# EAGLE design Vector_XY_Driver (EAGLE 9.0.1)
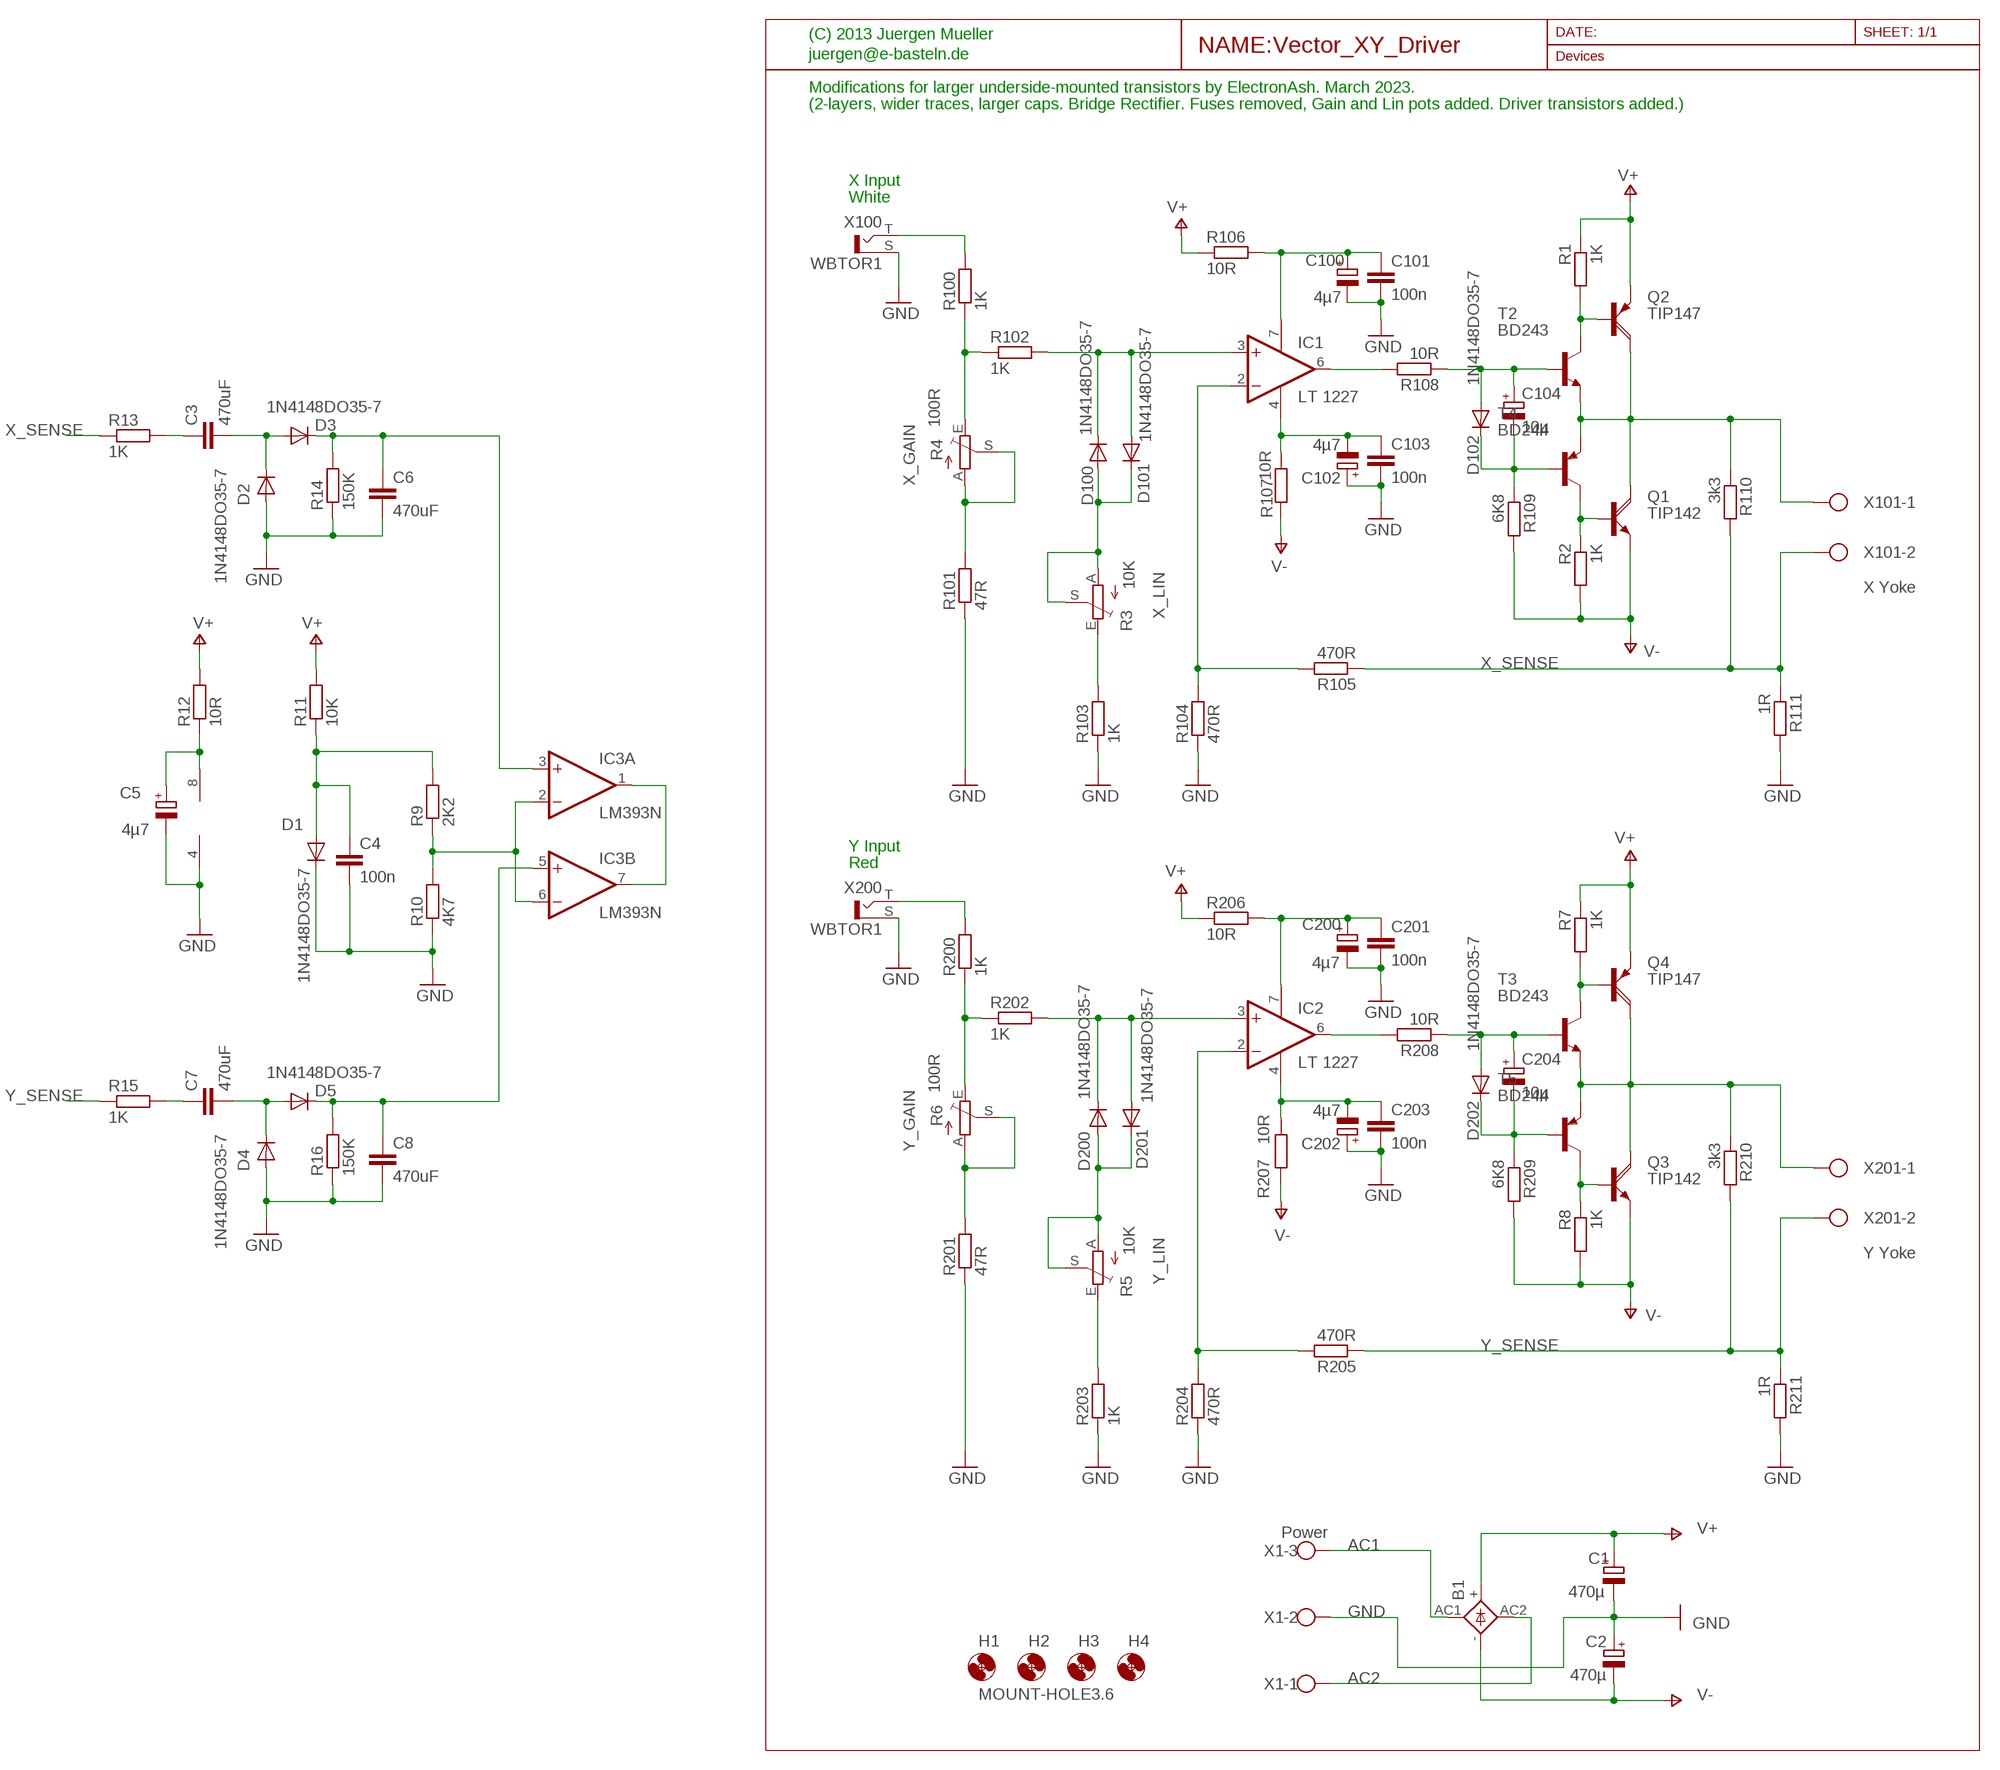
[diagram p0: schematic, sheet 1]

## Parts
B1  2KBP  [2KBP]
C1  470µ  CPOL-EUE7.5-16  [E7,5-16]
C2  470µ  CPOL-EUE7.5-16  [E7,5-16]
C3  470uF  C-EU025_050-025X075  [C025_050-025X075]
C4  100n  C-EU025_050-025X075  [C025_050-025X075]
C5  4µ7  CPOL-EUE2.5-6  [E2,5-6]
C6  470uF  C-EU025_050-025X075  [C025_050-025X075]
C7  470uF  C-EU025_050-025X075  [C025_050-025X075]
C8  470uF  C-EU025_050-025X075  [C025_050-025X075]
C100  4µ7  CPOL-EUE2.5-6  [E2,5-6]
C101  100n  C-EU025_050-025X075  [C025_050-025X075]
C102  4µ7  CPOL-EUE2.5-6  [E2,5-6]
C103  100n  C-EU025_050-025X075  [C025_050-025X075]
C104  10µ  CPOL-EUE15-5AXIAL  [E15-5]
C200  4µ7  CPOL-EUE2.5-6  [E2,5-6]
C201  100n  C-EU025_050-025X075  [C025_050-025X075]
C202  4µ7  CPOL-EUE2.5-6  [E2,5-6]
C203  100n  C-EU025_050-025X075  [C025_050-025X075]
C204  10µ  CPOL-EUE15-5AXIAL  [E15-5]
D1  1N4148DO35-7  [DO35-7]
D2  1N4148DO35-7  [DO35-7]
D3  1N4148DO35-7  [DO35-7]
D4  1N4148DO35-7  [DO35-7]
D5  1N4148DO35-7  [DO35-7]
D100  1N4148DO35-7  [DO35-7]
D101  1N4148DO35-7  [DO35-7]
D102  1N4148DO35-7  [DO35-7]
D200  1N4148DO35-7  [DO35-7]
D201  1N4148DO35-7  [DO35-7]
D202  1N4148DO35-7  [DO35-7]
H1  MOUNT-HOLE3.6  [3,6]
H2  MOUNT-HOLE3.6  [3,6]
H3  MOUNT-HOLE3.6  [3,6]
H4  MOUNT-HOLE3.6  [3,6]
IC1  LT 1227  1AMP_P7+4N  [DIL08]
IC2  LT 1227  1AMP_P7+4N  [DIL08]
IC3  LM393N  [DIL08]
Q1  TIP142  [SOT93]
Q2  TIP147  [SOT93]
Q3  TIP142  [SOT93]
Q4  TIP147  [SOT93]
R1  1K  R-EU_0207/10  [0207/10]
R2  1K  R-EU_0207/10  [0207/10]
R3  10K  TRIM_EU-B25P  [B25P]
R4  100R  TRIM_EU-B25P  [B25P]
R5  10K  TRIM_EU-B25P  [B25P]
R6  100R  TRIM_EU-B25P  [B25P]
R7  1K  R-EU_0207/10  [0207/10]
R8  1K  R-EU_0207/10  [0207/10]
R9  2K2  R-EU_0207/10  [0207/10]
R10  4K7  R-EU_0207/10  [0207/10]
R11  10K  R-EU_0207/10  [0207/10]
R12  10R  R-EU_0207/10  [0207/10]
R13  1K  R-EU_0207/10  [0207/10]
R14  150K  R-EU_0207/10  [0207/10]
R15  1K  R-EU_0207/10  [0207/10]
R16  150K  R-EU_0207/10  [0207/10]
R100  1K  R-EU_0207/10  [0207/10]
R101  47R  R-EU_0207/10  [0207/10]
R102  1K  R-EU_0207/10  [0207/10]
R103  1K  R-EU_0207/10  [0207/10]
R104  470R  R-EU_0207/10  [0207/10]
R105  470R  R-EU_0207/10  [0207/10]
R106  10R  R-EU_0207/12  [0207/12]
R107  10R  R-EU_0207/12  [0207/12]
R108  10R  R-EU_0207/12  [0207/12]
R109  6K8  R-EU_0207/10  [0207/10]
R110  3k3  R-EU_0207/10  [0207/10]
R111  1R  R-EU_0617/17  [0617/17]
R200  1K  R-EU_0207/10  [0207/10]
R201  47R  R-EU_0207/10  [0207/10]
R202  1K  R-EU_0207/10  [0207/10]
R203  1K  R-EU_0207/10  [0207/10]
R204  470R  R-EU_0207/10  [0207/10]
R205  470R  R-EU_0207/10  [0207/10]
R206  10R  R-EU_0207/12  [0207/12]
R207  10R  R-EU_0207/12  [0207/12]
R208  10R  R-EU_0207/12  [0207/12]
R209  6K8  R-EU_0207/10  [0207/10]
R210  3k3  R-EU_0207/10  [0207/10]
R211  1R  R-EU_0617/17  [0617/17]
T2  BD243  [TO220]
T3  BD243  [TO220]
T4  BD244  [TO220]
T5  BD244  [TO220]
X1  Power  W237-103  [W237-103]
X100  WBTOR1  [WBTOR1]
X101  X Yoke  W237-102  [W237-102]
X200  WBTOR1  [WBTOR1]
X201  Y Yoke  W237-102  [W237-102]

## Nets
AC1: B1.AC1 X1.3
AC2: B1.AC2 X1.1
GND: C1.- C2.+ C4.2 C5.- C6.2 C8.2 C100.- C101.2 C102.+ C103.2 C200.- C201.2 C202.+ C203.2 D1.C D2.A D4.A IC3.4(P:V-) R10.1 R14.1 R16.1 R101.1 R103.1 R104.1 R111.2 R201.1 R203.1 R204.1 R211.2 X1.2 X100.S X200.S
N$1: C102.- C103.1 IC1.4(V-) R107.1
N$2: C100.+ C101.1 IC1.7(V+) R106.2
N$3: IC1.2(-IN) R104.2 R105.2
N$4: R3.E R103.2
N$5: IC1.6(OUT) R108.2
N$6: C104.+ D102.A R108.1 T2.1(B)
N$7: C104.- D102.C R109.1 T4.1(B)
N$8: Q2.B R1.2 T2.2(C)
N$9: D100.A D101.C R3.A R3.S
N$10: R5.E R203.2
N$11: IC3.1(A:OUT) IC3.7(B:OUT)
N$14: D100.C D101.A IC1.3(+IN) R102.2
N$15: R4.E R100.1 R102.1
N$16: R100.2 X100.T
N$17: C202.- C203.1 IC2.4(V-) R207.1
N$18: C200.+ C201.1 IC2.7(V+) R206.2
N$19: IC2.6(OUT) R208.2
N$20: C204.+ D202.A R208.1 T3.1(B)
N$21: C204.- D202.C R209.1 T5.1(B)
N$22: Q3.C Q4.C R210.1 T3.3(E) T5.3(E) X201.1
N$23: Q1.C Q2.C R110.1 T2.3(E) T4.3(E) X101.1
N$25: Q1.B R2.1 T4.2(C)
N$26: IC2.2(-IN) R204.2 R205.2
N$27: C5.+ IC3.8(P:V+) R12.1
N$28: D200.C D201.A IC2.3(+IN) R202.2
N$29: R6.E R200.1 R202.1
N$30: R200.2 X200.T
N$31: R4.A R4.S R101.2
N$32: R6.A R6.S R201.2
N$33: D200.A D201.C R5.A R5.S
N$34: Q3.B R8.1 T5.2(C)
N$35: Q4.B R7.2 T3.2(C)
N$36: IC3.2(A:-IN) IC3.6(B:-IN) R9.1 R10.2
N$37: C4.1 D1.A R9.2 R11.1
N$40: C6.1 D3.C IC3.3(A:+IN) R14.2
N$41: C3.2 D2.C D3.A
N$42: C3.1 R13.2
N$43: C8.1 D5.C IC3.5(B:+IN) R16.2
N$44: C7.2 D4.C D5.A
N$45: C7.1 R15.2
V+: B1.+ C1.+ Q2.E Q4.E R1.1 R7.1 R11.2 R12.2 R106.1 R206.1
V-: B1.- C2.- Q1.E Q3.E R2.2 R8.2 R107.2 R109.2 R207.2 R209.2
X_SENSE: R13.1 R105.1 R110.2 R111.1 X101.2
Y_SENSE: R15.1 R205.1 R210.2 R211.1 X201.2

## Notes on the sheet
- (C) 2013 Juergen Mueller
- juergen@e-basteln.de
- Modifications for larger underside-mounted transistors by ElectronAsh. March 2023.
- (2-layers, wider traces, larger caps. Bridge Rectifier. Fuses removed, Gain and Lin pots added. Driver transistors added.)
- X Input
- White
- X_GAIN
- X_LIN
- Y Input
- Red
- Y_GAIN
- Y_LIN

## Library data of the parts
B1 = rectifier:2KBP: RECTIFIER grid 3 x 3,81 mm
C1 C2 C5 C100 C102 C104 C200 C202 C204 = rcl:CPOL-EU: POLARIZED CAPACITOR, European symbol
C3 C4 C6-C8 C101 C103 C201 C203 = rcl:C-EU: CAPACITOR, European symbol
D1-D5 D100-D102 D200-D202 = diode:1N4148: DIODE high speed (Philips)
H1-H4 = holes:MOUNT-HOLE: MOUNTING HOLE with drill center marker
IC1 IC2 = linear:1AMP_P7+4: OP AMP
IC3 = linear:LM393: COMPARATOR
Q1 Q3 = transistor-power:TIP142: NPN DARLINGTON TRANSISTOR
Q2 Q4 = transistor-power:TIP147: PNP DARLINGTON TRANSISTOR
R1 R2 R7-R16 R100-R111 R200-R211 = rcl:R-EU_: RESISTOR, European symbol
R3-R6 = pot:TRIM_EU-: POTENTIOMETER
T2 T3 = transistor:BD243: NPN TRANSISTOR Source: Motorola Semiconductor, Master Selection Guide Q3/95 SG73 REV 8 page 5.5-4
T4 T5 = transistor:BD244: PNP TRANSISTOR Source: Motorola Semiconductor, Master Selection Guide Q3/95 SG73 REV 8 page 5.5-5
X1 = con-wago-500:W237-103: WAGO SCREW CLAMP; MPN: 237-103; OC_FARNELL: unknown; OC_NEWARK: 18M7116
X100 X200 = con-lumberg:WBTOR1: RCA connectors according to JEITA RC-5231 Cinch RCA-Einbaukupplung nach JEITA RC-5231, abgewinkelte Ausführung Source: http://www.lumberg.de/Produkte/PDFs/WBTOR1.pdf; MPN: WBTOR 1 BLACK; OC_FARNELL: 1200146; OC_NEWARK: 98K2588
X101 X201 = con-wago-500:W237-102: WAGO SCREW CLAMP; MPN: 237-102; OC_FARNELL: unknown; OC_NEWARK: 70K9898

## Board
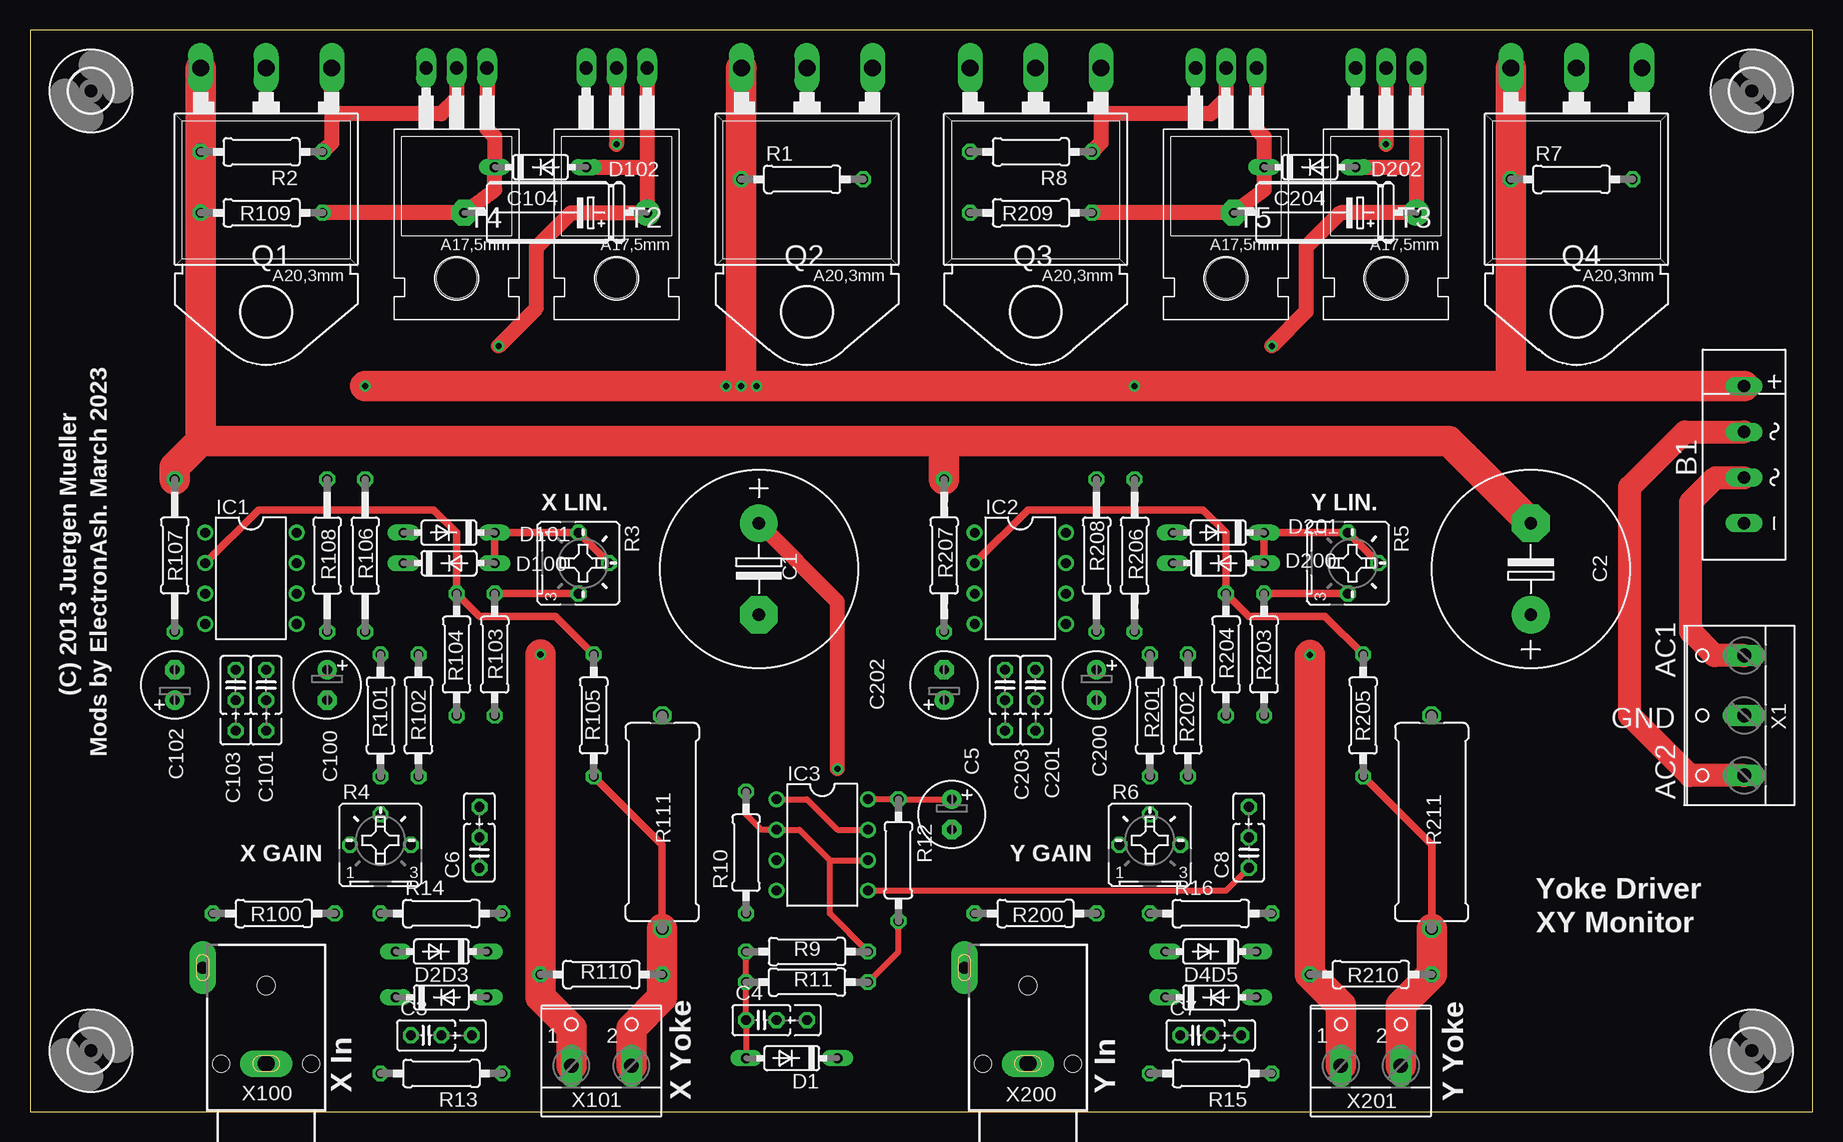
[diagram p1: board, top side]
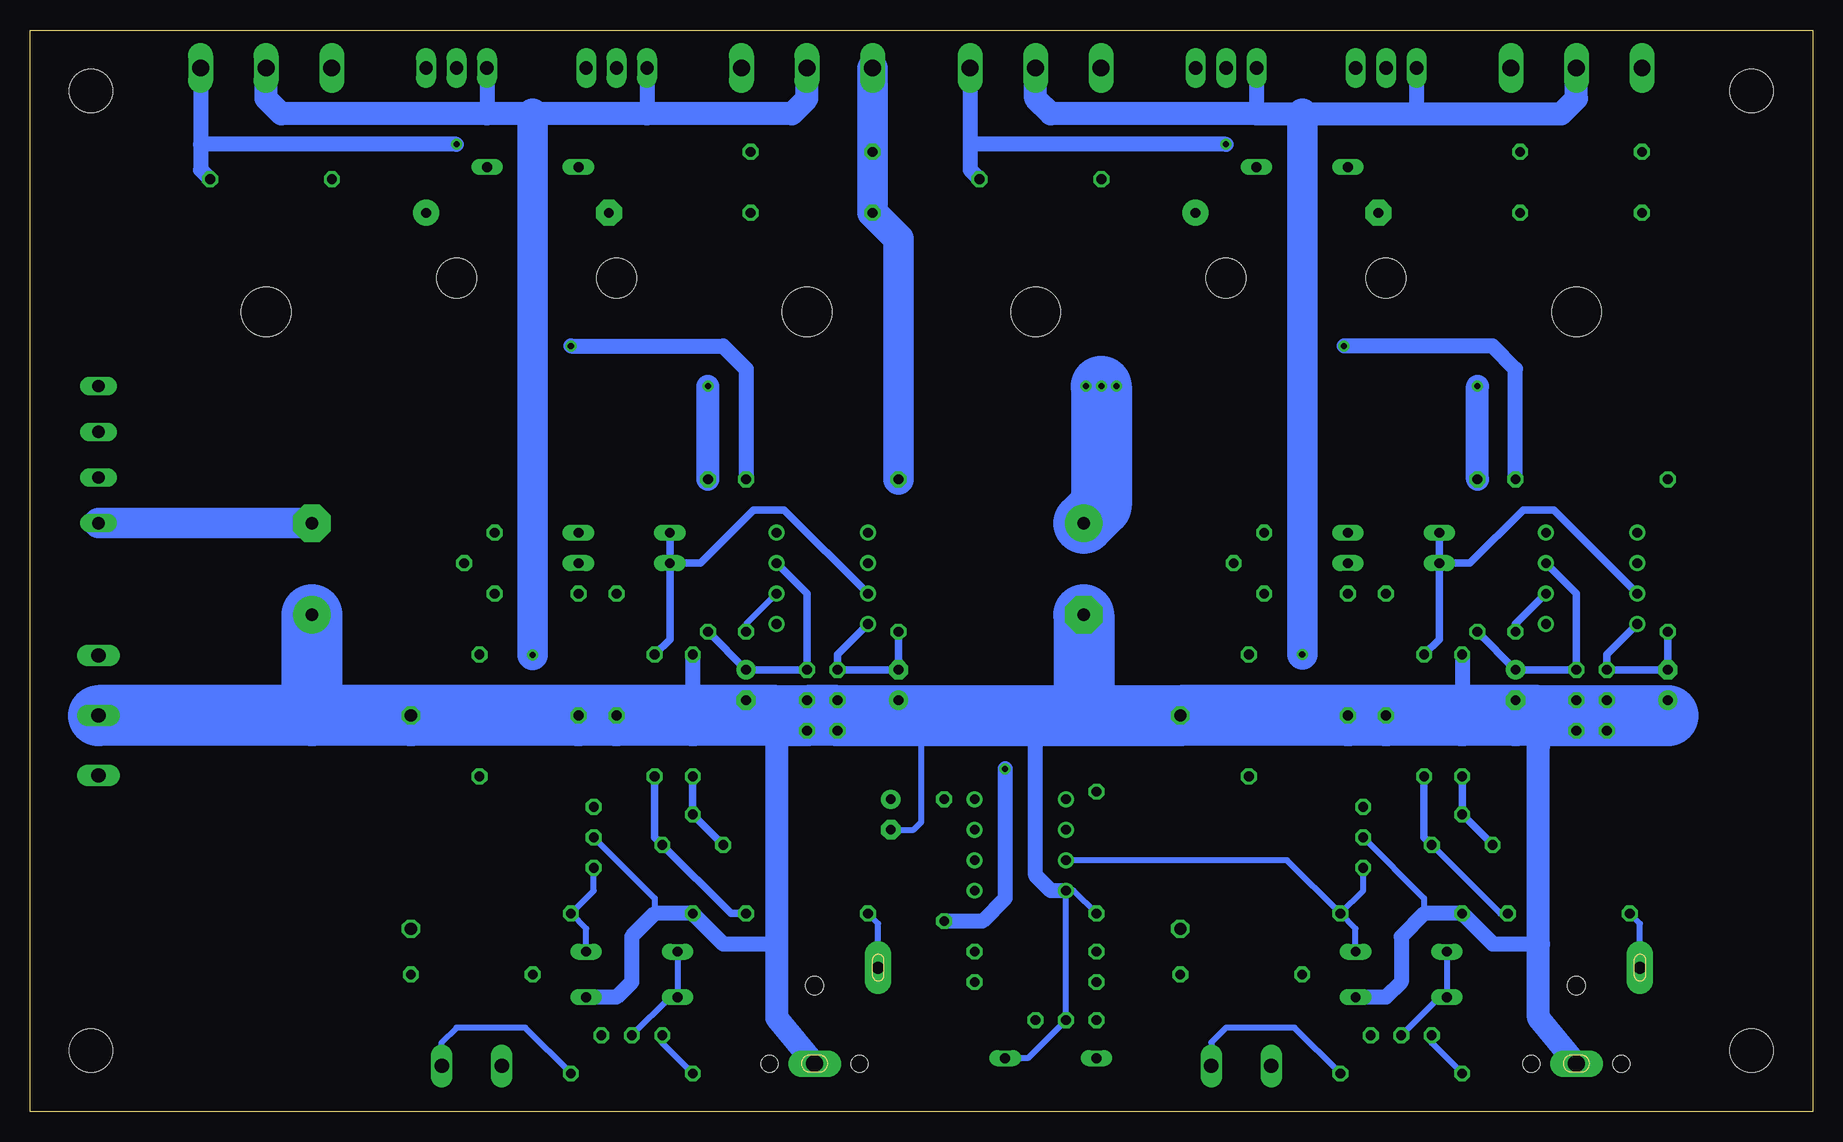
[diagram p2: board, bottom side, seen from below]

Size 148.59 x 90.17 mm. Coordinates in mm from the lower left corner, seen from the top.
Outline: 0,0 148.59,0 148.59,90.17 0,90.17 0,0
Copper layers (1*16): Top 0.035mm / dielectric 1.5mm / Bottom 0.035mm
Design rules "default *": minimum track width 10mil, minimum drill 20mil, track to track 8mil, track to pad 8mil, pad to pad 8mil, via to via 8mil, smd to smd 8mil, copper to edge 40mil, drill to drill 8mil, minimum pad ring 10mil, minimum via ring 8mil, stop-mask expansion 4mil, vias tented up to drill 24mil, thermal gap 10mil

### Footprints (pad centres in the part's own frame; a part is rotated, then mirrored left to right if it is on the bottom)
2KBP = drill 1.016 long: + 5.715,0; - -5.715,0; AC1 -1.905,0; AC2 1.905,0
E7,5-16 = drill 1.016 pad 3.15: + -3.81,0 | drill 1.016 pad 3.15 octagon: - 3.81,0
C025_050-025X075 = drill 0.813 octagon: 1 -1.27,0; 2 1.27,0; 3 3.81,0
E2,5-6 = drill 0.813 pad 1.6: + -1.27,0 | drill 0.813 pad 1.6 octagon: - 1.27,0
E15-5 = drill 0.813 pad 2.159: + -7.62,0 | drill 0.813 pad 2.159 octagon: - 7.62,0
DO35-7 = drill 0.813 long: A 3.81,0; C -3.81,0
3,6 = hole 3.6: 0,0
DIL08 = drill 0.813 pad 1.27: 1 -3.81,-3.81; 2 -1.27,-3.81; 3 1.27,-3.81; 4 3.81,-3.81; 5 3.81,3.81; 6 1.27,3.81; 7 -1.27,3.81; 8 -3.81,3.81
SOT93 = drill 1.397 long: B -5.461,-10.16; C 0,-10.16; E 5.461,-10.16 | hole 4.115: 0,10.16
0207/10 = drill 0.813 octagon: 1 -5.08,0; 2 5.08,0
B25P = drill 0.813 octagon: A -2.54,0; E 2.54,0; S 0,2.54
0207/12 = drill 0.813 octagon: 1 -6.35,0; 2 6.35,0
0617/17 = drill 1.016 octagon: 1 -8.89,0; 2 8.89,0
TO220 = drill 1.118 long: 1 -2.54,-6.35; 2 0,-6.35; 3 2.54,-6.35 | hole 3.302: 0,11.176
W237-103 = drill 1.194 long: 1 -5,-1.29; 2 0,-1.29; 3 5,-1.29
WBTOR1 = drill 1.4 pad 2.2 long: S 0,-4 | drill 1 pad 2.2 long: T 5.3,-12 | hole 1.4: -3.75,-4; 3.75,-4 | hole 1.5: 0,-10.5
W237-102 = drill 1.194 long: 1 -2.5,-1.27; 2 2.5,-1.27

### Placement (x,y rotation side)
B1  142.88,54.76 90 top
C1  60.75,45.24 270 top
C2  125.09,45.24 90 top
C3  33.02,6.35 0 top
C4  60.96,7.62 0 top
C5  76.83,24.77 270 top
C6  37.47,21.59 90 top
C7  97.16,6.35 0 top
C8  101.6,21.59 90 top
C100  24.77,35.56 270 top
C101  19.68,35.56 270 top
C102  12.06,35.56 90 top
C103  17.14,35.56 270 top
C104  43.81,74.93 180 top
C200  88.9,35.56 270 top
C201  83.82,35.56 270 top
C202  76.2,35.56 90 top
C203  81.28,35.56 270 top
C204  107.95,74.93 180 top
D1  63.5,4.45 180 top
D2  34.29,9.52 0 top
D3  34.29,13.34 180 top
D4  98.42,9.52 0 top
D5  98.42,13.34 180 top
D100  34.92,45.72 0 top
D101  34.92,48.26 180 top
D102  42.55,78.74 0 top
D200  99.06,45.72 0 top
D201  99.06,48.26 180 top
D202  106.68,78.74 0 top
H1  5.08,85.09 0 top
H2  5.08,5.08 0 top
H3  143.51,5.08 0 top
H4  143.51,85.09 0 top
IC1  18.41,44.45 270 top
IC2  82.55,44.45 270 top
IC3  66.04,22.23 270 top
Q1  19.68,76.84 180 top
Q2  64.77,76.84 180 top
Q3  83.82,76.84 180 top
Q4  128.91,76.84 180 top
R1  64.36,77.72 0 top
R2  19.3,80.01 180 top
R3  45.72,45.72 270 top
R4  29.21,22.23 0 top
R5  109.86,45.72 270 top
R6  93.34,22.23 0 top
R7  128.5,77.72 0 top
R8  83.44,80.01 180 top
R9  64.77,13.34 180 top
R10  59.69,21.59 90 top
R11  64.77,10.8 0 top
R12  72.39,20.95 270 top
R13  34.29,3.18 180 top
R14  34.29,16.51 0 top
R15  98.42,3.18 180 top
R16  98.42,16.51 0 top
R100  20.32,16.51 180 top
R101  29.21,33.02 270 top
R102  32.38,33.02 90 top
R103  38.73,38.1 90 top
R104  35.56,38.1 90 top
R105  46.99,33.02 90 top
R106  27.94,46.35 270 top
R107  12.06,46.35 90 top
R108  24.77,46.35 270 top
R109  19.3,74.93 180 top
R110  47.62,11.43 0 top
R111  52.7,24.13 90 top
R200  83.82,16.51 180 top
R201  93.34,33.02 270 top
R202  96.52,33.02 90 top
R203  102.87,38.1 90 top
R204  99.69,38.1 90 top
R205  111.12,33.02 90 top
R206  92.08,46.35 270 top
R207  76.2,46.35 90 top
R208  88.9,46.35 270 top
R209  83.44,74.93 180 top
R210  111.76,11.43 0 top
R211  116.84,24.13 90 top
T2  48.9,80.65 180 top
T3  113.03,80.65 180 top
T4  35.56,80.65 180 top
T5  99.69,80.65 180 top
X1  141.6,33.02 90 top
X100  19.68,0 180 top
X101  47.62,5.08 0 top
X200  83.19,0 180 top
X201  111.76,5.08 0 top

### Tracks (layer width: path | path; a pad name or v marks a point on that pad's centre or on a via)
AC1
  Top 1.93: X1.3 140.41,38.02 138.43,40.01 138.43,50.8 140.49,52.86 B1.AC1
AC2
  Top 1.93: X1.1 138.35,28.02 133.35,33.02 133.35,52.07 137.95,56.67 B1.AC2
GND
  Bottom 0.254: 17.14,33.02 C103.2 | 81.28,33.02 C203.2 | 83.82,33.02 C201.2 | 12.06,33.02 C102.+ | 24.77,33.02 C100.- | 22.86,30.48 22.86,33.02
  Bottom 0.508: C203.2 C202.+ 74.3,33.66 74.3,24.13 74.93,23.49 C5.- | R10.1 61.59,18.41 IC3.4 C4.2 65.41,4.45 D1.C | C8.2 96.52,17.78 96.52,16.51 | C6.2 32.38,17.78 32.38,16.51
  Bottom 1.27: R201.1 93.34,33.02 | R101.1 29.21,33.02 | IC3.4 63.5,18.41 64.77,19.68 64.77,33.02 | 22.86,13.97 26.67,13.97 R14.1 32.38,16.51 34.29,14.61 34.29,10.8 35.56,9.52 D2.A | 86.36,13.97 90.81,13.97 R16.1 96.52,16.51 98.42,14.61 98.42,10.8 99.69,9.52 D4.A
  Bottom 1.676: 19.68,33.02 C101.2
  Bottom 1.93: X100.S 22.86,7.81 22.86,13.97 22.86,30.48 | 36.83,31.75 R104.1 | C200.- 86.36,33.02 86.36,13.97 86.36,7.81 X200.S
  Bottom 5.08: 12.06,33.02 17.14,33.02 19.68,33.02 22.86,33.02 24.77,33.02 29.21,33.02 R104.1 R103.1 R111.2 60.96,33.02 | 60.96,33.02 64.77,33.02 81.28,33.02 83.82,33.02 86.36,33.02 93.34,33.02 R204.1 R203.1 R211.2 125.09,33.02 | 125.09,33.02 X1.2 | C2.+ 125.09,33.02 | C1.- 60.75,33.23 60.96,33.02
N$1
  Bottom 0.61: IC1.4 17.14,38.1 C103.1 C102.- R107.1
N$2
  Bottom 0.61: IC1.7 19.68,43.18 C101.1 C100.+ R106.2
N$3
  Top 0.61: IC1.2 19.05,50.16 33.66,50.16 35.56,48.26 R104.2 37.47,41.27 43.81,41.27 R105.2
N$4
  Top 0.61: R103.2 R3.E
N$5
  Bottom 0.61: IC1.6 24.77,40.64 R108.2
N$6  (via drill 0.51)
  Top 1.27: T2.1 51.44,78.74 | 51.44,78.74 C104.+ 45.09,74.93 42.23,72.07 42.23,66.99 v39.05,63.82 | D102.A 51.44,78.74
  Bottom 1.27: R108.1 24.77,61.91 26.67,63.82 v39.05,63.82
N$7
  Top 1.27: R109.1 C104.- 38.73,76.84 D102.C 38.73,81.28 38.1,81.91 T4.1
N$8  (via drill 0.51)
  Top 1.27: T2.2 v48.9,80.65
  Bottom 1.27: Q2.B 70.23,80.65 | 70.23,80.65 70.23,78.51 R1.2 | v48.9,80.65 70.23,80.65
N$9
  Top 0.61: D100.A D101.C R3.A R3.S
N$10
  Top 0.61: R203.2 R5.E
N$11
  Top 0.508: IC3.1 64.77,26.04 67.31,23.49 IC3.7
N$14
  Bottom 0.61: D100.C D101.A | IC1.3 21.59,50.16 24.13,50.16 28.57,45.72 D100.C | R102.2 31.11,39.37 D100.C
N$15
  Bottom 0.508: R100.1 26.04,16.51 R4.E
  Bottom 0.61: R4.E 32.38,22.86 R102.1
N$16
  Bottom 0.508: X100.T 14.38,15.66 R100.2
N$17
  Bottom 0.61: R207.1 C202.- C203.1 81.28,38.1 IC2.4
N$18
  Bottom 0.61: R206.2 C200.+ C201.1 83.82,43.18 IC2.7
N$19
  Bottom 0.508: IC2.6 88.9,40.64 R208.2
N$20  (via drill 0.51)
  Top 1.27: T3.1 115.57,78.74 | 115.57,78.74 C204.+ 109.22,74.93 106.36,72.07 106.36,66.68 v103.5,63.82 | D202.A 115.57,78.74
  Bottom 1.27: v103.5,63.82 90.81,63.82 88.9,61.91 R208.1
N$21
  Top 1.27: R209.1 C204.- 102.87,76.84 D202.C 102.87,81.28 102.23,81.91 T5.1
N$22  (via drill 0.51)
  Top 2.54: X201.1 109.26,8.85 R210.1 v106.68,38.06
  Bottom 1.27: T3.3 110.49,83.19 | T5.3 97.16,83.19
  Bottom 1.93: Q3.C 83.82,84.46 85.09,83.19 97.16,83.19 106.68,83.19 110.49,83.19 127.64,83.19 128.91,84.46 Q4.C
  Bottom 2.54: v106.68,38.06 106.68,83.19
N$23  (via drill 0.51)
  Top 2.54: v42.55,38.1 R110.1 42.55,9.52 45.12,6.95 X101.1
  Bottom 1.27: T4.3 33.02,83.19 | T2.3 46.35,83.19
  Bottom 1.93: Q2.C 64.77,84.46 63.5,83.19 46.35,83.19 42.55,83.19 33.02,83.19 20.95,83.19 19.68,84.46 Q1.C
  Bottom 2.54: v42.55,38.1 42.55,83.19
N$25
  Top 1.27: T4.2 35.56,84.46 34.29,83.19 25.15,83.19 | 25.15,83.19 Q1.B | 25.15,83.19 25.15,80.77 R2.1
N$26
  Top 0.61: IC2.2 83.19,50.16 97.79,50.16 99.69,48.26 R204.2 101.6,41.27 107.95,41.27 R205.2
N$27
  Top 0.508: IC3.8 R12.1 C5.+
N$28
  Bottom 0.61: D200.C D201.A | R202.2 95.25,39.37 D200.C | IC2.3 85.72,50.16 88.27,50.16 92.71,45.72 D200.C
N$29
  Bottom 0.61: R200.1 90.17,16.51 R6.E 96.52,22.86 R202.1
N$30
  Bottom 0.508: X200.T 77.89,15.66 R200.2
N$31
  Bottom 0.61: R4.A R4.S R101.2
N$32
  Bottom 0.61: R6.A R6.S R201.2
N$33
  Top 0.61: D200.A D201.C R5.A R5.S
N$34
  Top 1.27: T5.2 99.69,84.46 98.42,83.19 89.28,83.19 | 89.28,83.19 Q3.B | 89.28,83.19 89.28,80.77 R8.1
N$35  (via drill 0.51)
  Top 1.27: T3.2 v113.03,80.65
  Bottom 1.27: Q4.B 134.37,80.65 | 134.37,80.65 134.37,78.51 R7.2 | v113.03,80.65 134.37,80.65
N$36
  Top 0.508: 66.67,20.95 IC3.6 | 66.67,20.95 64.14,23.49 IC3.2 60.96,23.49 59.69,24.77 R10.2 | R9.1 66.67,16.51 66.67,20.95
N$37
  Top 0.508: R9.2 R11.1 C4.1 D1.A
N$40
  Bottom 0.508: D3.C 38.1,15.24 R14.2 | R14.2 37.47,18.41 C6.1 | R14.2 43.81,20.95 IC3.3
N$41
  Bottom 0.508: C3.2 31.11,9.52 D2.C D3.A
N$42
  Bottom 0.508: R13.2 31.75,5.71 C3.1
N$43
  Top 0.508: C8.1 99.69,18.41 IC3.5
  Bottom 0.508: D5.C 102.23,15.24 R16.2 101.6,18.41 C8.1
N$44
  Bottom 0.508: C7.2 95.25,9.52 D4.C D5.A
N$45
  Bottom 0.508: R15.2 95.89,5.71 C7.1
V+  (via drill 0.51)
  Top 0.508: R11.2 72.39,13.34 R12.2
  Top 1.27: C1.+ 67.31,42.49 v67.31,28.58
  Top 2.54: Q4.E 123.42,87 R7.1 123.42,60.71 123.19,60.48 | Q2.E 59.28,86.97 R1.1 v59.28,60.48 | B1.+ 123.19,60.48 | 123.19,60.48 v92.08,60.48 v60.55,60.48 v59.28,60.48 | v59.28,60.48 v58.01,60.48 v27.94,60.48
  Bottom 1.27: v67.31,28.58 67.31,17.78 69.22,15.88 R12.2
  Bottom 1.93: R206.1 v92.08,60.48 | R106.1 v27.94,60.48
  Bottom 5.08: C1.+ 59.28,50.52 v59.28,60.48
V-
  Top 2.54: 76.2,55.88 R207.2 | 14.22,55.88 R109.2 R2.2 Q1.E | 76.2,55.88 14.22,55.88 | 14.22,55.88 12.06,53.72 R107.2 | C2.- 118.26,55.88 76.2,55.88
  Bottom 2.54: C2.- B1.- | Q3.E R8.2 R209.2 76.2,72.77 R207.2
X_SENSE
  Top 0.61: R105.1 52.7,22.23 R111.1
  Top 2.54: X101.2 50.12,6.95 52.7,9.52 R110.2 R111.1
  Bottom 0.508: R13.1 43.18,6.98 48.9,6.98 50.12,5.75 X101.2
Y_SENSE
  Top 0.61: R211.1 116.84,22.23 R205.1
  Top 2.54: X201.2 114.26,8.85 R210.2 R211.1
  Bottom 0.508: R15.1 107.31,6.98 113.03,6.98 114.3,5.71 114.3,3.85 X201.2

### Text on the board
tPlace: X LIN. | Y LIN. | AC1 | (C) 2013 Juergen Mueller | GND | Mods by ElectronAsh. March 2023 | AC2 | X GAIN | Y GAIN | Yoke Driver | XY Monitor | X In | Y In | X Yoke | Y Yoke